# Altium schematic sheet INC_enc_driver.SchDoc
size A4; SheetNumber: 5; SheetTotal: 8
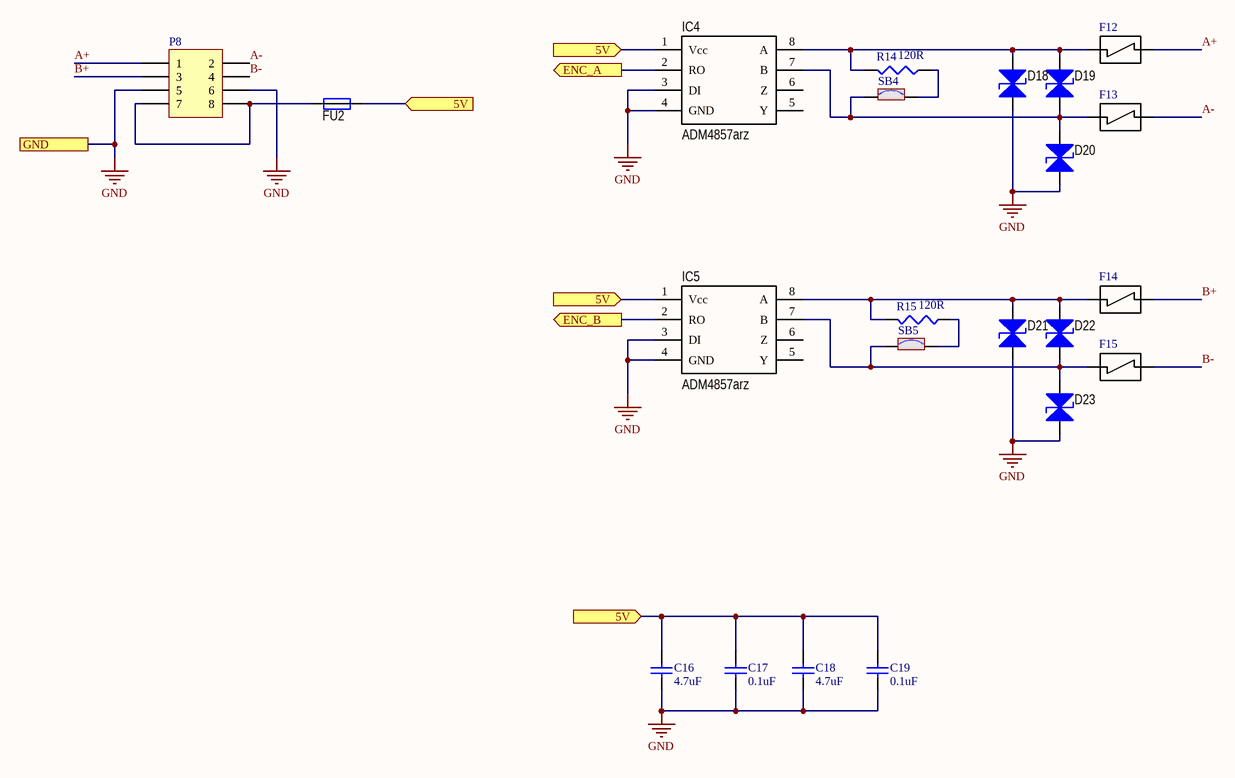
[diagram p0: INC_enc_driver.SchDoc]

## Parts
C16  4.7uF  [C1608-0603]
C17  0.1uF  [C1608-0603]
C18  4.7uF  [C1608-0603]
C19  0.1uF  [C1608-0603]
D18  SMBJ5.0CA  [SMB_H]  (value not drawn)
D19  SMBJ5.0CA  [SMB_H]  (value not drawn)
D20  SMBJ5.0CA  [SMB_H]  (value not drawn)
D21  SMBJ5.0CA  [SMB_H]  (value not drawn)
D22  SMBJ5.0CA  [SMB_H]  (value not drawn)
D23  SMBJ5.0CA  [SMB_H]  (value not drawn)
F12  TBU-CA065-200-WH  [TBU_CA]  (value not drawn)
F13  TBU-CA065-200-WH  [TBU_CA]  (value not drawn)
F14  TBU-CA065-200-WH  [TBU_CA]  (value not drawn)
F15  TBU-CA065-200-WH  [TBU_CA]  (value not drawn)
FU2  MF-MSMF030  [MF-MSMF]  (value not drawn)
IC4  ADM4857arz  [SO8_N]
IC5  ADM4857arz  [SO8_N]
P8  BH-08  [BH-08]  (value not drawn)
R14  120R  [R1608-0603]
R15  120R  [R1608-0603]
SB4  (no value)  [SOLDER-BRIDGE_R0603-0R]  (no BOM)
SB5  (no value)  [SOLDER-BRIDGE_R0603-0R]  (no BOM)

## Ports
5V (in), ENC_A (out), ENC_B (out), GND

## Nets
GND: C16.1 C17.1 C18.1 C19.1 D18.1(K) D20.1(K) D21.1(K) D23.1(K) IC4.3(DI) IC4.4(GND) IC5.3(DI) IC5.4(GND) P8.5 P8.6 ; port GND
5V: C16.2 C17.2 C18.2 C19.2 FU2.2 IC4.1(Vcc) IC5.1(Vcc) ; port 5V
A+: F12.1 P8.1
A-: F13.1 P8.2
B+: F14.1 P8.3
B-: F15.1 P8.4
ENC_A: IC4.2(RO) ; port ENC_A
ENC_B: IC5.2(RO) ; port ENC_B
NetD18_2: D18.2(A) D19.2(A) F12.0 IC4.8(A) R14.2
NetD19_1: D19.1(K) D20.2(A) F13.0 IC4.7(B) SB4.1
NetD21_2: D21.2(A) D22.2(A) F14.0 IC5.8(A) R15.2
NetD22_1: D22.1(K) D23.2(A) F15.0 IC5.7(B) SB5.1
NetFU2_1: FU2.1 P8.7 P8.8
NetR14_1: R14.1 SB4.2
NetR15_1: R15.1 SB5.2

Not connected (* = marked no-connect by the designer): IC4 5(Y) 6(Z); IC5 5(Y) 6(Z)

## Library data of the parts
C16-C19 = Cap: Керамическийконденсатор; Корпус: 0603 (1608 Metric); Диэлектрик: X5R; Напряжение: 16B; Вид монтажа: SMD; Температурный диапазон: -55 ~ 100; Тип элемента: Керамический конденсатор
  C16 C18: Номинал: 4.7uF
  C17 C19: Номинал: 0.1uF
D18-D23 = SMBJ_CА: Супрессор двунаправленный; Производитель: ST MICROELECTRONICS CO., LTD.; Корпус: DO-214AA, SMB; Номинал: 5В; Вид монтажа: SMD; Тип элемента: Защитный диод; Температурный диапазон: -55°C ~ 150°C; Название: SMBJ5.0CA; Артикул: SMBJ5.0CA; ComponentLink: http://www.digikey.com/product-detail/en/SMBJ5.0CA/SMBJ5.0CABTR-ND/2254207
F12-F15 = TBU-CA: Самовосстанавливающийся предохранитель; Производитель: Bourns; Корпус: DFN; Номинал: 0.4A; Вид монтажа: SMD; Температурный диапазон: -40 to +125 °C; Название: TBU-CA065-200-WH; Артикул: TBU-CA065-200-WH; Тип элемента: Самовосстанавливающийся предохранитель
FU2 = MF-MSMF030: PTC Resettable Fuses; Производитель: Bourns; Корпус: 1812; Номинал: 0.3А; Вид монтажа: SMD; Тип элемента: Самовосстанавливающийся предохранитель; Температурный диапазон: -40…85; Напряжение: 13.2В; Название: MF-MSMF030; Артикул: MF-MSMF030
IC4 IC5 = ADM4857: RS-485 Трансивер; Производитель: Analog Devices; Корпус: SOIC8; Вид монтажа: SMD; Тип элемента: Драйвер интерфейса RS-485; Температурный диапазон: -40°C ~ 85°C; Артикул: ADM4857arz; Название: ADM4857arz
P8 = BH-08: Разъем штыревой на плату; Производитель: Connfly electronic (Zhenqin); Номинал: 1А; Напряжение: 300В; Вид монтажа: DIP; Температурный диапазон: -55…140; Примечание: шаг 2.54 мм; Название: BH-08; Артикул: BH-08; Тип элемента: Разъем
R14 R15 = resistor: SMD резистор; Производитель: 1%; Корпус: 0603 (1608 Metric); Номинал: 120R; Точность: 1%; Название: Резистор; Вид монтажа: SMD; Тип элемента: Резистор
SB4 SB5 = SB: Перемычка